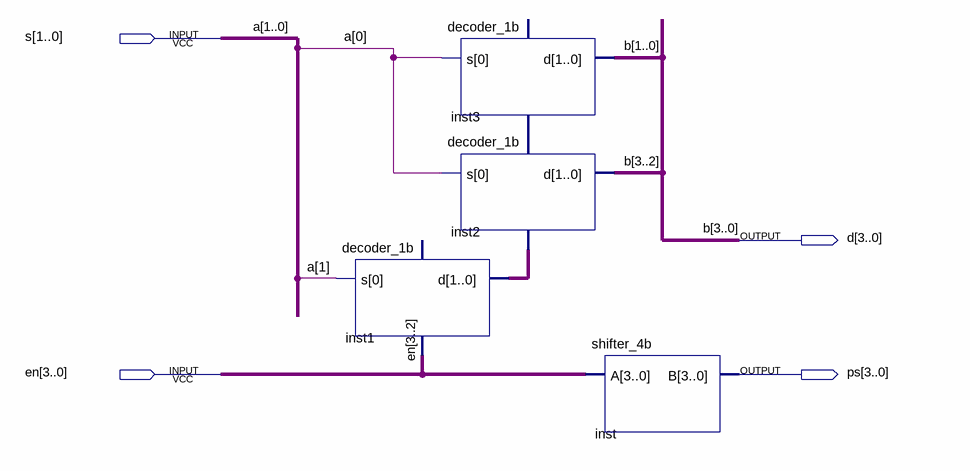
[diagram p0: schematic sheet]
// Quartus schematic decoder_2b.bdf as structural Verilog: 4 symbols, 4 pins
module decoder_2b (
  input  [1:0] s,
  input  [3:0] en,
  output [3:0] d,
  output [3:0] ps
);

  wire [1:0] inst1_d, inst2_ps;

  decoder_1b inst1 (.s(s[1]), .en(en[3:2]), .d(inst1_d));  // open: ps
  decoder_1b inst3 (.s(s[0]), .en(inst2_ps), .d(d[1:0]));  // open: ps
  decoder_1b inst2 (.s(s[0]), .en(inst1_d), .d(d[3:2]), .ps(inst2_ps));
  shifter_4b inst (.A(en), .B(ps));

  // Other names for the same wires on the sheet: a[1:0] = s; b[3:0] = d
endmodule
